# Altium schematic sheet Sheet1.SchDoc
size A
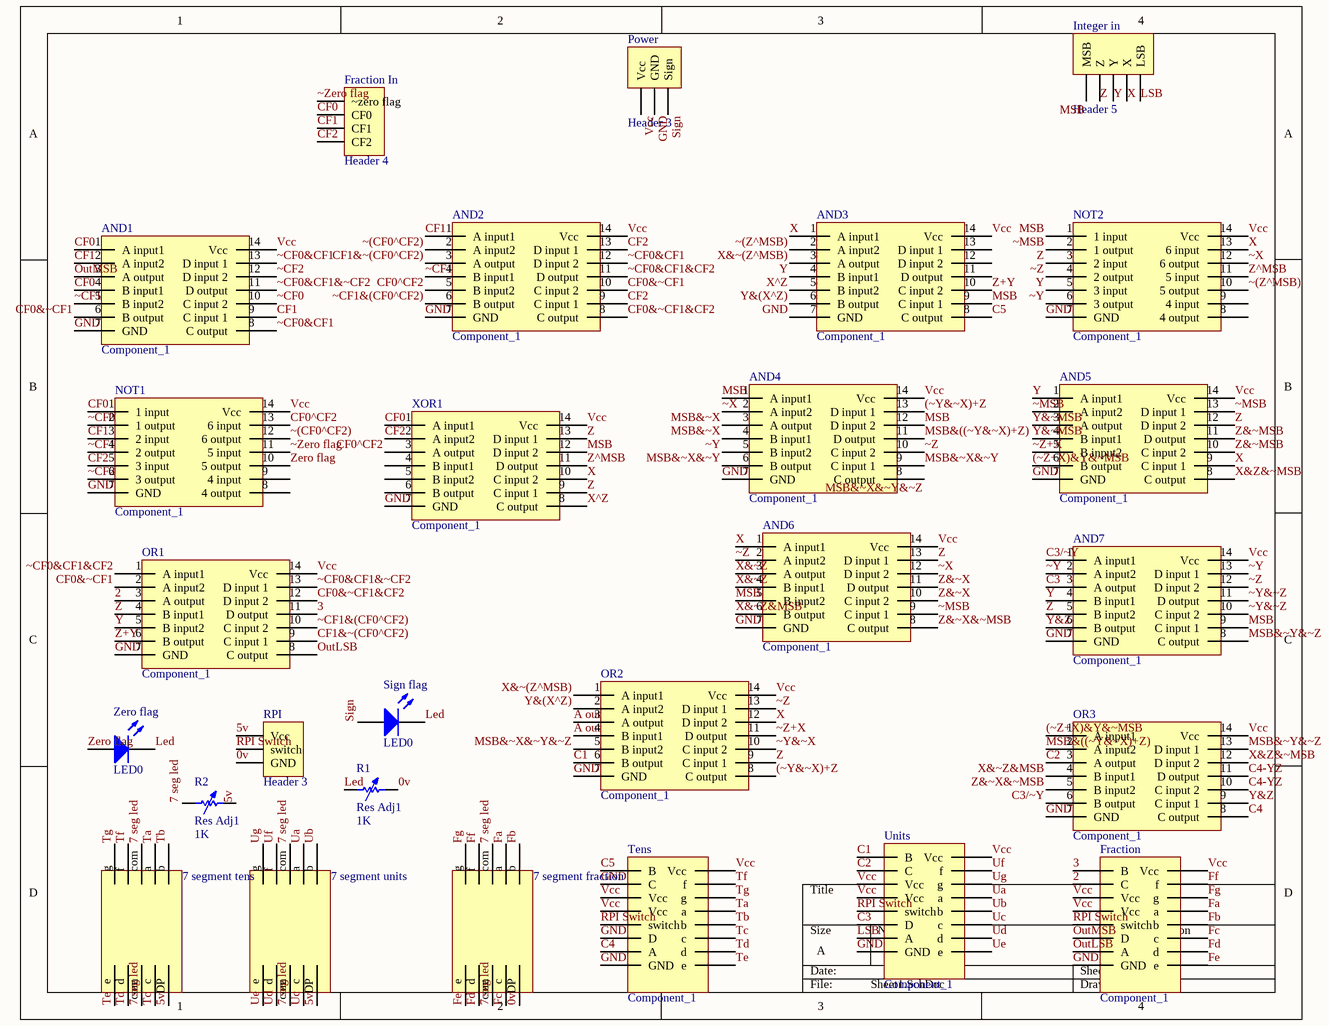
[diagram p0: Sheet1.SchDoc]

## Parts
7_segment_fraction  Component_1  [7 segment]  (value not drawn)
7_segment_tens  Component_1  [7 segment]  (value not drawn)
7_segment_units  Component_1  [7 segment]  (value not drawn)
AND1  Component_1  [Gate?]
AND2  Component_1  [Gate?]
AND3  Component_1  [Gate?]
AND4  Component_1  [Gate?]
AND5  Component_1  [Gate?]
AND6  Component_1  [Gate?]
AND7  Component_1  [Gate?]
Fraction  Component_1  [7483]
Fraction_In  Header 4  [HDR1X4]
Integer_in  Header 5  [HDR1X5]
NOT1  Component_1  [Gate?]
NOT2  Component_1  [Gate?]
OR1  Component_1  [Gate?]
OR2  Component_1  [Gate?]
OR3  Component_1  [Gate?]
Power  Header 3  [HDR1X3]
R1  Res Adj1  value 1K  [AXIAL-0.7]
R2  Res Adj1  value 1K  [AXIAL-0.7]
RPI  Header 3  [HDR1X3]
Sign_flag  LED0  [LED-0]
Tens  Component_1  [7483]
Units  Component_1  [7483]
XOR1  Component_1  [Gate?]
Zero_flag  LED0  [LED-0]

## Nets
0v: 7_segment_fraction.DP R1.2 RPI.3(GND)
2: Fraction.C3(C) OR1.3(A_output)
3: Fraction.A4(B) OR1.11(D_output)
5v: 7_segment_tens.DP 7_segment_units.DP R2.2 RPI.1(Vcc)
7 seg led: 7_segment_fraction.com 7_segment_tens.com 7_segment_units.com R2.1
(~Y&~X)+Z: AND4.13(D_input_1) OR2.8(C_output)
(~Z+X)&Y&~MSB: AND5.6(B_output) OR3.1(A_input1)
A out: OR2.3(A_output) OR2.4(B_input1)
C1: OR2.6(B_output) Units.A4(B)
C2: OR3.3(A_output) Units.C3(C)
C3: AND7.3(A_output) Units.C2(D)
C3/~Y: AND7.1(A_input1) OR3.6(B_output)
C4: OR3.8(C_output) Tens.B2(A)
C4-YZ: OR3.10(C_input_2) OR3.11(D_output)
C5: AND3.8(C_output) Tens.A4(B)
CF0: AND1.1(A_input1) AND1.4(B_input1) Fraction_In.2(CF0) NOT1.1(1_input) XOR1.1(A_input1)
CF0&~CF1: AND1.6(B_output) AND2.10(C_input_2) OR1.2(A_input2)
CF0&~CF1&CF2: AND2.8(C_output) OR1.12(D_input_2)
CF0^CF2: AND2.5(B_input2) NOT1.13(6_input) XOR1.3(A_output)
CF1: AND1.2(A_input2) AND1.9(C_input_1) AND2.1(A_input1) Fraction_In.3(CF1) NOT1.3(2_input)
CF1&~(CF0^CF2): AND2.3(A_output) OR1.9(C_input_1)
CF2: AND2.9(C_input_1) AND2.13(D_input_1) Fraction_In.4(CF2) NOT1.5(3_input) XOR1.2(A_input2)
Fa: 7_segment_fraction.a Fraction.C0(a)
Fb: 7_segment_fraction.b Fraction.GND(b)
Fc: 7_segment_fraction.c Fraction.B1(c)
Fd: 7_segment_fraction.d Fraction.A1(d)
Fe: 7_segment_fraction.e Fraction.C1(e)
Ff: 7_segment_fraction.f Fraction.C4(f)
Fg: 7_segment_fraction.g Fraction.C5(g)
GND: AND1.7(GND) AND2.7(GND) AND3.7(GND) AND4.7(GND) AND5.7(GND) AND6.7(GND) AND7.7(GND) Fraction.A2(GND) NOT1.7(GND) NOT2.7(GND) OR1.7(GND) OR2.7(GND) OR3.7(GND) Power.2(GND) Tens.A2(GND) Tens.C2(D) Tens.C3(C) Units.A2(GND) XOR1.7(GND)
Led: R1.1 Sign_flag.2(K) Zero_flag.2(K)
LSB: Integer_in.5(LSB) Units.B2(A)
MSB: AND3.9(C_input_1) AND4.1(A_input1) AND4.12(D_input_2) AND6.5(B_input2) AND7.9(C_input_1) Integer_in.1(MSB) NOT2.1(1_input) XOR1.12(D_input_2)
MSB&((~Y&~X)+Z): AND4.11(D_output) OR3.2(A_input2)
MSB&~X: AND4.3(A_output) AND4.4(B_input1)
MSB&~X&~Y: AND4.6(B_output) AND4.9(C_input_1)
MSB&~X&~Y&~Z: AND4.8(C_output) OR2.5(B_input2)
MSB&~Y&~Z: AND7.8(C_output) OR3.13(D_input_1)
OutLSB: Fraction.B2(A) OR1.8(C_output)
OutMSB: AND1.3(A_output) Fraction.C2(D)
RPI Switch: Fraction.Vcc(switch) RPI.2(switch) Tens.Vcc(switch) Units.Vcc(switch)
Sign: Power.3(Sign) Sign_flag.1(A)
Ta: 7_segment_tens.a Tens.C0(a)
Tb: 7_segment_tens.b Tens.GND(b)
Tc: 7_segment_tens.c Tens.B1(c)
Td: 7_segment_tens.d Tens.A1(d)
Te: 7_segment_tens.e Tens.C1(e)
Tf: 7_segment_tens.f Tens.C4(f)
Tg: 7_segment_tens.g Tens.C5(g)
Ua: 7_segment_units.a Units.C0(a)
Ub: 7_segment_units.b Units.GND(b)
Uc: 7_segment_units.c Units.B1(c)
Ud: 7_segment_units.d Units.A1(d)
Ue: 7_segment_units.e Units.C1(e)
Uf: 7_segment_units.f Units.C4(f)
Ug: 7_segment_units.g Units.C5(g)
Vcc: AND1.14(Vcc) AND2.14(Vcc) AND3.14(Vcc) AND4.14(Vcc) AND5.14(Vcc) AND6.14(Vcc) AND7.14(Vcc) Fraction.A3(Vcc) Fraction.B3(Vcc) Fraction.B4(Vcc) NOT1.14(Vcc) NOT2.14(Vcc) OR1.14(Vcc) OR2.14(Vcc) OR3.14(Vcc) Power.1(Vcc) Tens.A3(Vcc) Tens.B3(Vcc) Tens.B4(Vcc) Units.A3(Vcc) Units.B3(Vcc) Units.B4(Vcc) XOR1.14(Vcc)
X: AND3.1(A_input1) AND5.9(C_input_1) AND6.1(A_input1) Integer_in.4(X) NOT2.13(6_input) OR2.12(D_input_2) XOR1.10(C_input_2)
X&Z&~MSB: AND5.8(C_output) OR3.12(D_input_2)
X&~(Z^MSB): AND3.3(A_output) OR2.1(A_input1)
X&~Z: AND6.3(A_output) AND6.4(B_input1)
X&~Z&MSB: AND6.6(B_output) OR3.4(B_input1)
X^Z: AND3.5(B_input2) XOR1.8(C_output)
Y: AND3.4(B_input1) AND5.1(A_input1) AND7.4(B_input1) Integer_in.3(Y) NOT2.5(3_input) OR1.5(B_input2)
Y&(X^Z): AND3.6(B_output) OR2.2(A_input2)
Y&Z: AND7.6(B_output) OR3.9(C_input_1)
Y&~MSB: AND5.3(A_output) AND5.4(B_input1)
Z: AND5.12(D_input_2) AND6.13(D_input_1) AND7.5(B_input2) Integer_in.2(Z) NOT2.3(2_input) OR1.4(B_input1) OR2.9(C_input_1) XOR1.9(C_input_1) XOR1.13(D_input_1)
Z&~MSB: AND5.10(C_input_2) AND5.11(D_output)
Z&~X: AND6.10(C_input_2) AND6.11(D_output)
Z&~X&~MSB: AND6.8(C_output) OR3.5(B_input2)
Z+Y: AND3.10(C_input_2) OR1.6(B_output)
Z^MSB: NOT2.11(5_input) XOR1.11(D_output)
Zero flag: NOT1.10(5_output) Zero_flag.1(A)
~(CF0^CF2): AND2.2(A_input2) NOT1.12(6_output)
~(Z^MSB): AND3.2(A_input2) NOT2.10(5_output)
~CF0: AND1.10(C_input_2) NOT1.2(1_output)
~CF0&CF1: AND1.8(C_output) AND1.13(D_input_1) AND2.12(D_input_2)
~CF0&CF1&CF2: AND2.11(D_output) OR1.1(A_input1)
~CF0&CF1&~CF2: AND1.11(D_output) OR1.13(D_input_1)
~CF1: AND1.5(B_input2) AND2.4(B_input1) NOT1.4(2_output)
~CF1&(CF0^CF2): AND2.6(B_output) OR1.10(C_input_2)
~CF2: AND1.12(D_input_2) NOT1.6(3_output)
~MSB: AND5.2(A_input2) AND5.13(D_input_1) AND6.9(C_input_1) NOT2.2(1_output)
~X: AND4.2(A_input2) AND6.12(D_input_2) NOT2.12(6_output)
~Y: AND4.5(B_input2) AND7.2(A_input2) AND7.13(D_input_1) NOT2.6(3_output)
~Y&~X: OR2.10(C_input_2)
~Y&~Z: AND7.10(C_input_2) AND7.11(D_output)
~Z: AND4.10(C_input_2) AND6.2(A_input2) AND7.12(D_input_2) NOT2.4(2_output) OR2.13(D_input_1)
~Z+X: AND5.5(B_input2) OR2.11(D_output)
~Zero flag: Fraction_In.1(~zero_flag) NOT1.11(5_input)

Not connected (* = marked no-connect by the designer): AND3 11(D_output) 12(D_input_2) 13(D_input_1); NOT1 8(4_output) 9(4_input); NOT2 8(4_output) 9(4_input); XOR1 4(B_input1) 5(B_input2) 6(B_output)

## Library data of the parts
Fraction_In = Header 4: Header, 4-Pin; LatestRevisionDate: 17-Jul-2002; LatestRevisionNote: Re-released for DXP Platform.; Publisher: Altium Limited
Integer_in = Header 5: Header, 5-Pin; LatestRevisionDate: 17-Jul-2002; LatestRevisionNote: Re-released for DXP Platform.; Publisher: Altium Limited
Power RPI = Header 3: Header, 3-Pin; LatestRevisionDate: 17-Jul-2002; LatestRevisionNote: Re-released for DXP Platform.; Publisher: Altium Limited
R1 R2 = Res Adj1: Variable Resistor; Set Position: 0.5; Published: 8-Jun-2000; LatestRevisionDate: 17-Jul-2002; LatestRevisionNote: Re-released for DXP Platform.; PackageReference: AXIAL-0.7; Publisher: Altium Limited; PackageDescription: Axial Device, Thru-Hole; 2 Leads; 0.7 in Pin Spacing
Sign_flag Zero_flag = LED0: Typical INFRARED GaAs LED; Published: 8-Jun-2000; LatestRevisionDate: 08-Jul-2005; LatestRevisionNote: Mech Layer 1 removed.; PackageReference: LED-0; Publisher: Altium Limited; PackageDescription: LED; 2 Leads